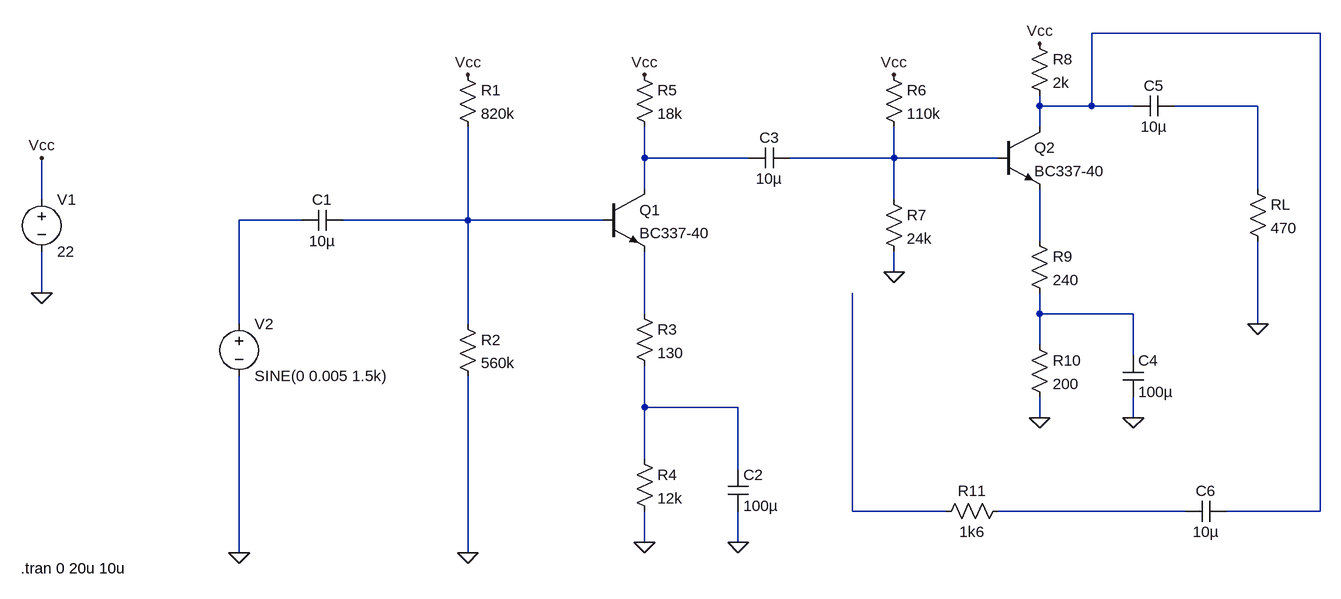
[diagram p0: schematic Simulacion_LazoAbierto.asc]
Simulacion_LazoAbierto.asc, the LTspice schematic file:
Version 4.1
SHEET 1 1396 856
WIRE 1392 16 1040 16
WIRE 960 128 960 112
WIRE 1040 128 1040 16
WIRE 1040 128 960 128
WIRE 1104 128 1040 128
WIRE 1296 128 1168 128
WIRE 960 160 960 128
WIRE 352 208 352 160
WIRE 512 208 352 208
WIRE 736 208 736 160
WIRE 736 208 576 208
WIRE 896 208 736 208
WIRE 352 256 352 208
WIRE 1296 256 1296 128
WIRE -576 272 -576 208
WIRE 736 272 736 208
WIRE -176 304 -272 304
WIRE 80 304 80 160
WIRE 80 304 -112 304
WIRE 288 304 80 304
WIRE 960 336 960 256
WIRE 736 384 736 352
WIRE -576 416 -576 352
WIRE 352 448 352 352
WIRE 960 448 960 416
WIRE 1104 448 960 448
WIRE -272 464 -272 304
WIRE 80 464 80 304
WIRE 1296 464 1296 336
WIRE 960 496 960 448
WIRE 1104 512 1104 448
WIRE 352 592 352 528
WIRE 496 592 352 592
WIRE 960 608 960 576
WIRE 1104 608 1104 576
WIRE 352 672 352 592
WIRE 496 688 496 592
WIRE 672 752 672 416
WIRE 816 752 672 752
WIRE 1184 752 896 752
WIRE 1392 752 1392 16
WIRE 1392 752 1248 752
WIRE 352 800 352 752
WIRE 496 800 496 752
WIRE -272 816 -272 544
WIRE 80 816 80 544
FLAG 960 608 0
FLAG 1104 608 0
FLAG 1296 464 0
FLAG 736 384 0
FLAG 496 800 0
FLAG 352 800 0
FLAG 80 816 0
FLAG -272 816 0
FLAG -576 416 0
FLAG -576 208 Vcc
FLAG 80 80 Vcc
FLAG 352 80 Vcc
FLAG 736 80 Vcc
FLAG 960 32 Vcc
SYMBOL res 64 64 R0
SYMATTR InstName R1
SYMATTR Value 820k
SYMBOL res 64 448 R0
SYMATTR InstName R2
SYMATTR Value 560k
SYMBOL cap -112 288 R90
WINDOW 0 0 32 VBottom 2
WINDOW 3 32 32 VTop 2
SYMATTR InstName C1
SYMATTR Value 10µ
SYMBOL res 336 432 R0
SYMATTR InstName R3
SYMATTR Value 130
SYMBOL res 336 656 R0
SYMATTR InstName R4
SYMATTR Value 12k
SYMBOL cap 480 688 R0
SYMATTR InstName C2
SYMATTR Value 100µ
SYMBOL res 336 64 R0
SYMATTR InstName R5
SYMATTR Value 18k
SYMBOL res 720 64 R0
SYMATTR InstName R6
SYMATTR Value 110k
SYMBOL cap 576 192 R90
WINDOW 0 0 32 VBottom 2
WINDOW 3 32 32 VTop 2
SYMATTR InstName C3
SYMATTR Value 10µ
SYMBOL npn 288 256 R0
SYMATTR InstName Q1
SYMATTR Value BC337-40
SYMBOL res 720 256 R0
SYMATTR InstName R7
SYMATTR Value 24k
SYMBOL npn 896 160 R0
SYMATTR InstName Q2
SYMATTR Value BC337-40
SYMBOL res 944 16 R0
SYMATTR InstName R8
SYMATTR Value 2k
SYMBOL res 944 320 R0
SYMATTR InstName R9
SYMATTR Value 240
SYMBOL res 944 480 R0
SYMATTR InstName R10
SYMATTR Value 200
SYMBOL cap 1088 512 R0
SYMATTR InstName C4
SYMATTR Value 100µ
SYMBOL cap 1168 112 R90
WINDOW 0 0 32 VBottom 2
WINDOW 3 32 32 VTop 2
SYMATTR InstName C5
SYMATTR Value 10µ
SYMBOL res 1280 240 R0
SYMATTR InstName RL
SYMATTR Value 470
SYMBOL voltage -576 256 R0
SYMATTR InstName V1
SYMATTR Value 22
SYMBOL cap 1248 736 R90
WINDOW 0 0 32 VBottom 2
WINDOW 3 32 32 VTop 2
SYMATTR InstName C6
SYMATTR Value 10µ
SYMBOL res 912 736 R90
WINDOW 0 0 56 VBottom 2
WINDOW 3 32 56 VTop 2
SYMATTR InstName R11
SYMATTR Value 1k6
SYMBOL voltage -272 448 R0
WINDOW 123 0 0 Left 0
WINDOW 39 0 0 Left 0
SYMATTR InstName V2
SYMATTR Value SINE(0 0.005 1.5k)
TEXT -608 840 Left 2 !.tran 0 20u 10u

The netlist it stands for:
* Simulacion_LazoAbierto.asc
R1 Vcc N006 820k
R2 N006 0 560k
C1 N006 N005 10µ
R3 N008 N010 130
R4 N010 0 12k
C2 N010 0 100µ
R5 Vcc N003 18k
R6 Vcc N004 110k
C3 N004 N003 10µ
Q1 N003 N006 N008 0 BC337-40
R7 N004 0 24k
Q2 N001 N004 N007 0 BC337-40
R8 Vcc N001 2k
R9 N007 N009 240
R10 N009 0 200
C4 N009 0 100µ
C5 N002 N001 10µ
RL N002 0 470
V1 Vcc 0 22
C6 N001 N012 10µ
R11 N012 N011 1k6
V2 N005 0 SINE(0 0.005 1.5k)
.model NPN NPN
.model PNP PNP
.lib standard.bjt
.tran 0 20u 10u
.backanno
.end